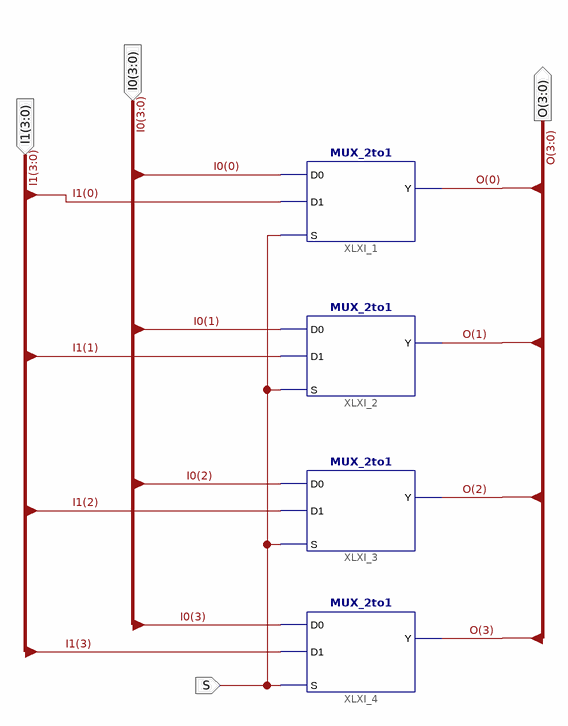
[diagram p0: schematic sheet 1]
// Xilinx ISE schematic MUX_2Way_4Bit.sch (spartan3e) as structural Verilog: 4 symbols, 4 ports
module MUX_2Way_4Bit (
  input  [3:0] I0,
  input  [3:0] I1,
  input  S,
  output [3:0] O
);

  MUX_2to1 XLXI_1 (.D0(I0[0]), .S(S), .D1(I1[0]), .Y(O[0]));
  MUX_2to1 XLXI_2 (.D0(I0[1]), .S(S), .D1(I1[1]), .Y(O[1]));
  MUX_2to1 XLXI_3 (.D0(I0[2]), .S(S), .D1(I1[2]), .Y(O[2]));
  MUX_2to1 XLXI_4 (.D0(I0[3]), .S(S), .D1(I1[3]), .Y(O[3]));
endmodule
